# Altium schematic sheet H-BRIDGE.SchDoc
size A; SheetNumber: 3; SheetTotal: 4
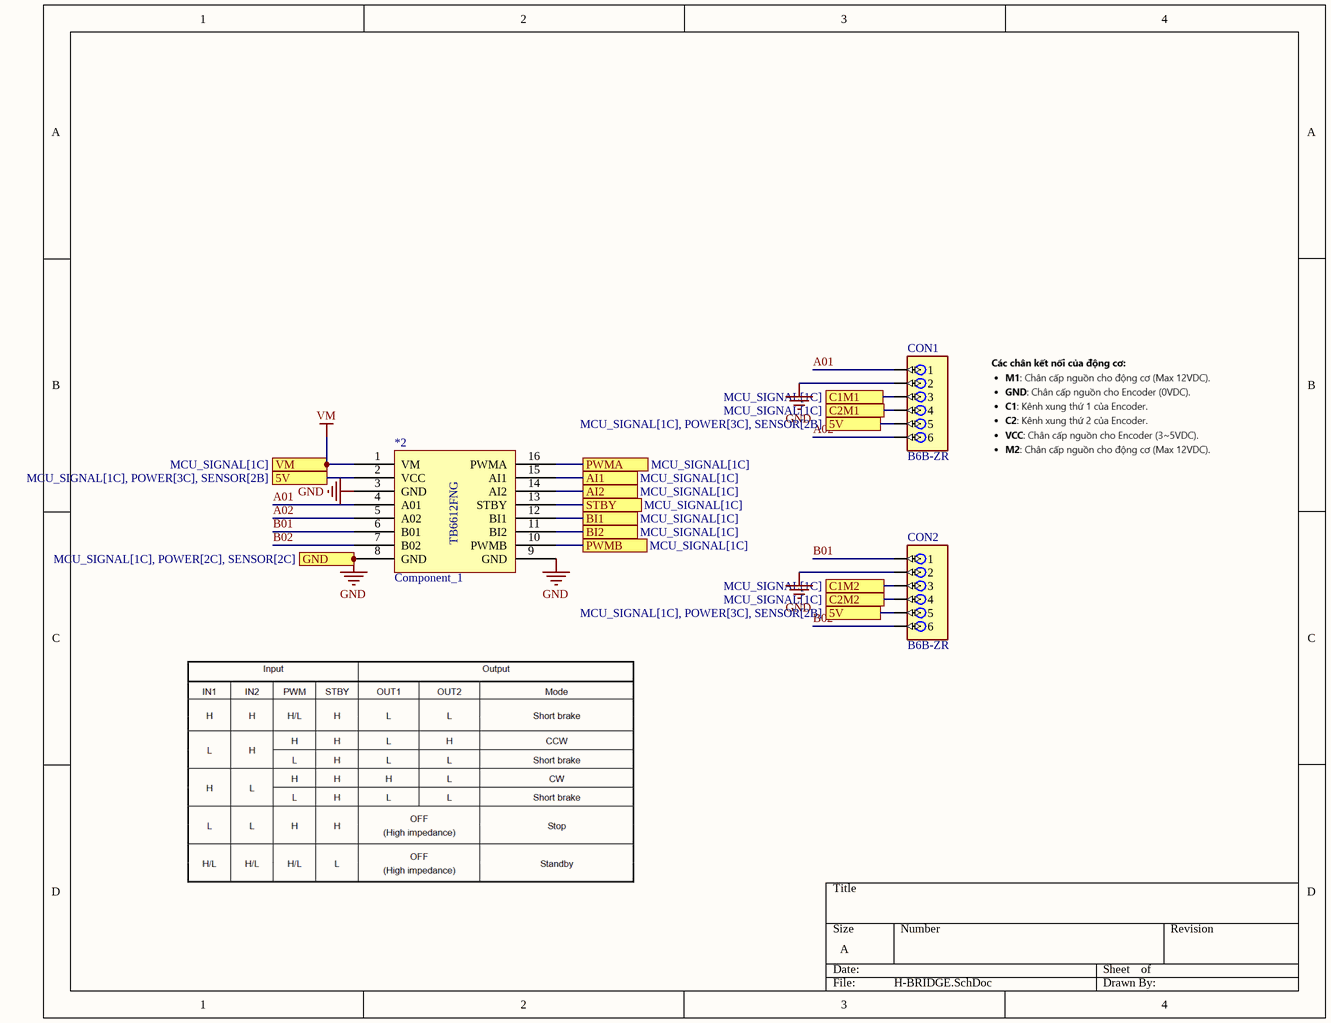
[diagram p0: H-BRIDGE.SchDoc]

## Parts
*2  Component_1  [PCBComponent_1]
CON1  B6B-ZR  [B6B-ZR]
CON2  B6B-ZR  [B6B-ZR]

## Ports
5V (see MCU_SIGNAL[1C], POWER[3C], SENSOR[2B]), AI1 (see MCU_SIGNAL[1C]), AI2 (see MCU_SIGNAL[1C]), BI1 (see MCU_SIGNAL[1C]), BI2 (see MCU_SIGNAL[1C]), C1M1 (see MCU_SIGNAL[1C]), C1M2 (see MCU_SIGNAL[1C]), C2M1 (see MCU_SIGNAL[1C]), C2M2 (see MCU_SIGNAL[1C]), GND (see MCU_SIGNAL[1C], POWER[2C], SENSOR[2C]), PWMA (see MCU_SIGNAL[1C]), PWMB (see MCU_SIGNAL[1C]), STBY (see MCU_SIGNAL[1C]), VM (see MCU_SIGNAL[1C])

## Nets
GND: *2.3(GND) *2.8(GND) *2.9(GND) CON1.2 CON2.2 ; port GND
VM: *2.1(VM) ; port VM
5V: *2.2(VCC) CON1.5 CON2.5 ; port 5V
A01: *2.4(A01) CON1.1
A02: *2.5(A02) CON1.6
AI1: *2.15(AI1) ; port AI1
AI2: *2.14(AI2) ; port AI2
B01: *2.6(B01) CON2.1
B02: *2.7(B02) CON2.6
BI1: *2.12(BI1) ; port BI1
BI2: *2.11(BI2) ; port BI2
C1M1: CON1.3 ; port C1M1
C1M2: CON2.3 ; port C1M2
C2M1: CON1.4 ; port C2M1
C2M2: CON2.4 ; port C2M2
PWMA: *2.16(PWMA) ; port PWMA
PWMB: *2.10(PWMB) ; port PWMB
STBY: *2.13(STBY) ; port STBY

## Notes on the sheet
- (in symbol Component_1) TB6612FNG

## Library data of the parts
CON1 CON2 = B6B-ZR: Connector Header Surface Mount 6 position 0.059 (1.50mm); MF: JST; Value: *; Check_prices: https://www.snapeda.com/parts/B6B-ZR/JST/view-part/?ref=eda; Price: None; MP: B6B-ZR; SnapEDA_Link: https://www.snapeda.com/parts/B6B-ZR/JST/view-part/?ref=snap; Availability: In Stock; Package: None